# EAGLE design servo_driver_board (EAGLE 7.2.0)
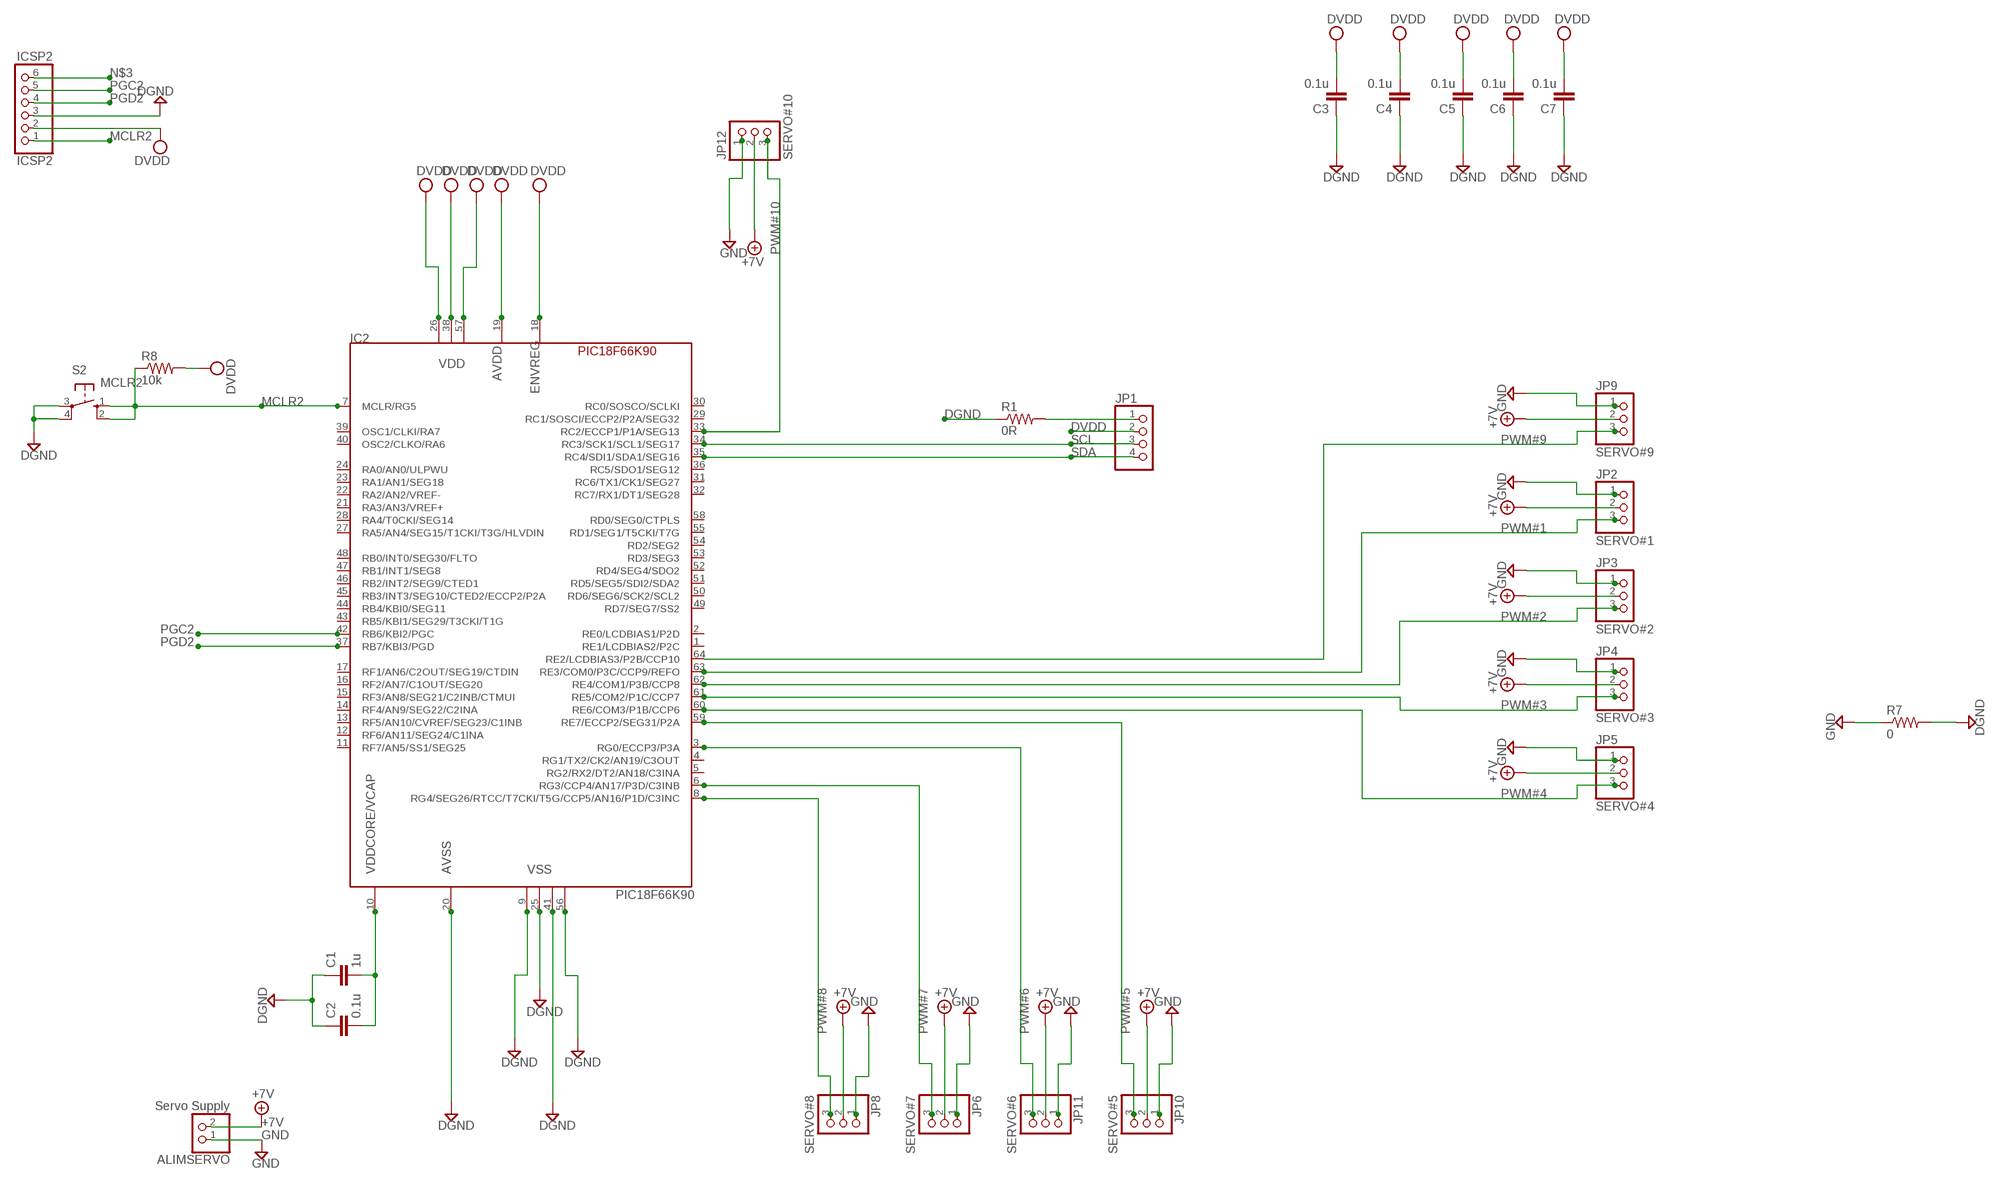
[diagram p0: schematic, sheet 1]

## Parts
ALIMSERVO  Servo Supply  PINHD-1X2  [1X02]
C1  1u  C-EUC0805  [C0805]
C2  0.1u  C-EUC0805  [C0805]
C3  0.1u  C-EUC0805  [C0805]
C4  0.1u  C-EUC0805  [C0805]
C5  0.1u  C-EUC0805  [C0805]
C6  0.1u  C-EUC0805  [C0805]
C7  0.1u  C-EUC0805  [C0805]
IC2  PIC18F66K90  [TQFP64-10X10]
ICSP2  ICSP2  PINHD-1X6  [1X06]
JP1  PINHD-1X4/90  [1X04/90]
JP2  SERVO#1  PINHD-1X3  [1X03]
JP3  SERVO#2  PINHD-1X3  [1X03]
JP4  SERVO#3  PINHD-1X3  [1X03]
JP5  SERVO#4  PINHD-1X3  [1X03]
JP6  SERVO#7  PINHD-1X3  [1X03]
JP8  SERVO#8  PINHD-1X3  [1X03]
JP9  SERVO#9  PINHD-1X3  [1X03]
JP10  SERVO#5  PINHD-1X3  [1X03]
JP11  SERVO#6  PINHD-1X3  [1X03]
JP12  SERVO#10  PINHD-1X3  [1X03]
R1  0R  R-US_R1206  [R1206]
R7  0  R-US_R1206  [R1206]
R8  10k  R-US_R1206  [R1206]
S2  MCLR2  10-XX  [B3F-10XX]

## Nets
+7V: ALIMSERVO.2 JP2.2 JP3.2 JP4.2 JP5.2 JP6.2 JP8.2 JP9.2 JP10.2 JP11.2 JP12.2
DGND: C1.1 C2.1 C3.1 C4.1 C5.1 C6.1 C7.1 IC2.9(VSS) IC2.20(AVSS) IC2.25(VSS) IC2.41(VSS) IC2.56(VSS) ICSP2.3 R1.1 R7.2 S2.3(P) S2.4(P1)
DVDD: C3.2 C4.2 C5.2 C6.2 C7.2 IC2.18(ENVREG) IC2.19(AVDD) IC2.26(VDD) IC2.38(VDD) IC2.57(VDD) ICSP2.2 JP1.2 R8.2
GND: ALIMSERVO.1 JP2.1 JP3.1 JP4.1 JP5.1 JP6.1 JP8.1 JP9.1 JP10.1 JP11.1 JP12.1 R7.1
MCLR2: IC2.7(MCLR/RG5) ICSP2.1 R8.1 S2.1(S) S2.2(S1)
N$2: JP1.1 R1.2
N$3: ICSP2.6
N$15: C1.2 C2.2 IC2.10(VDDCORE/VCAP)
PGC2: IC2.42(RB6/KBI2/PGC) ICSP2.5
PGD2: IC2.37(RB7/KBI3/PGD) ICSP2.4
PWM#1: IC2.63(RE3/COM0/P3C/CCP9/REFO) JP2.3
PWM#2: IC2.62(RE4/COM1/P3B/CCP8) JP3.3
PWM#3: IC2.61(RE5/COM2/P1C/CCP7) JP4.3
PWM#4: IC2.60(RE6/COM3/P1B/CCP6) JP5.3
PWM#5: IC2.59(RE7/ECCP2/SEG31/P2A) JP10.3
PWM#6: IC2.3(RG0/ECCP3/P3A) JP11.3
PWM#7: IC2.6(RG3/CCP4/AN17/P3D/C3INB) JP6.3
PWM#8: IC2.8(RG4/SEG26/RTCC/T7CKI/T5G/CCP5/AN16/P1D/C3INC) JP8.3
PWM#9: IC2.64(RE2/LCDBIAS3/P2B/CCP10) JP9.3
PWM#10: IC2.33(RC2/ECCP1/P1A/SEG13) JP12.3
SCL: IC2.34(RC3/SCK1/SCL1/SEG17) JP1.3
SDA: IC2.35(RC4/SDI1/SDA1/SEG16) JP1.4
Unconnected: IC2.1(RE1/LCDBIAS2/P2C) IC2.2(RE0/LCDBIAS1/P2D) IC2.4(RG1/TX2/CK2/AN19/C3OUT) IC2.5(RG2/RX2/DT2/AN18/C3INA) IC2.11(RF7/AN5/SS1/SEG25) IC2.12(RF6/AN11/SEG24/C1INA) IC2.13(RF5/AN10/CVREF/SEG23/C1INB) IC2.14(RF4/AN9/SEG22/C2INA) IC2.15(RF3/AN8/SEG21/C2INB/CTMUI) IC2.16(RF2/AN7/C1OUT/SEG20) IC2.17(RF1/AN6/C2OUT/SEG19/CTDIN) IC2.21(RA3/AN3/VREF+) IC2.22(RA2/AN2/VREF-) IC2.23(RA1/AN1/SEG18) IC2.24(RA0/AN0/ULPWU) IC2.27(RA5/AN4/SEG15/T1CKI/T3G/HLVDIN) IC2.28(RA4/T0CKI/SEG14) IC2.29(RC1/SOSCI/ECCP2/P2A/SEG32) IC2.30(RC0/SOSCO/SCLKI) IC2.31(RC6/TX1/CK1/SEG27) IC2.32(RC7/RX1/DT1/SEG28) IC2.36(RC5/SDO1/SEG12) IC2.39(OSC1/CLKI/RA7) IC2.40(OSC2/CLKO/RA6) IC2.43(RB5/KBI1/SEG29/T3CKI/T1G) IC2.44(RB4/KBI0/SEG11) IC2.45(RB3/INT3/SEG10/CTED2/ECCP2/P2A) IC2.46(RB2/INT2/SEG9/CTED1) IC2.47(RB1/INT1/SEG8) IC2.48(RB0/INT0/SEG30/FLTO) IC2.49(RD7/SEG7/SS2) IC2.50(RD6/SEG6/SCK2/SCL2) IC2.51(RD5/SEG5/SDI2/SDA2) IC2.52(RD4/SEG4/SDO2) IC2.53(RD3/SEG3) IC2.54(RD2/SEG2) IC2.55(RD1/SEG1/T5CKI/T7G) IC2.58(RD0/SEG0/CTPLS)

## Notes on the sheet
- PWM#10
- PWM#9
- PWM#1
- PWM#2
- PWM#3
- PWM#4
- PWM#8 | PWM#7 | PWM#6 | PWM#5

## Library data of the parts
ALIMSERVO = pinhead:PINHD-1X2: PIN HEADER
C1-C7 = rcl:C-EU: CAPACITOR, European symbol
IC2 = PIC18F66K90:PIC18F66K90: DATASHEET: http://ww1.microchip.com/downloads/en/DeviceDoc/39957d.pdf Por Nicolás Cifuentes.
ICSP2 = pinhead:PINHD-1X6: PIN HEADER
JP1 = pinhead:PINHD-1X4: PIN HEADER
JP2-JP6 JP8-JP12 = pinhead:PINHD-1X3: PIN HEADER
R1 R7 R8 = rcl:R-US_: RESISTOR, American symbol
S2 = switch-omron:10-XX: OMRON SWITCH; MPN: B3F-1000; OC_FARNELL: 176432; OC_NEWARK: 36M3542

## Board
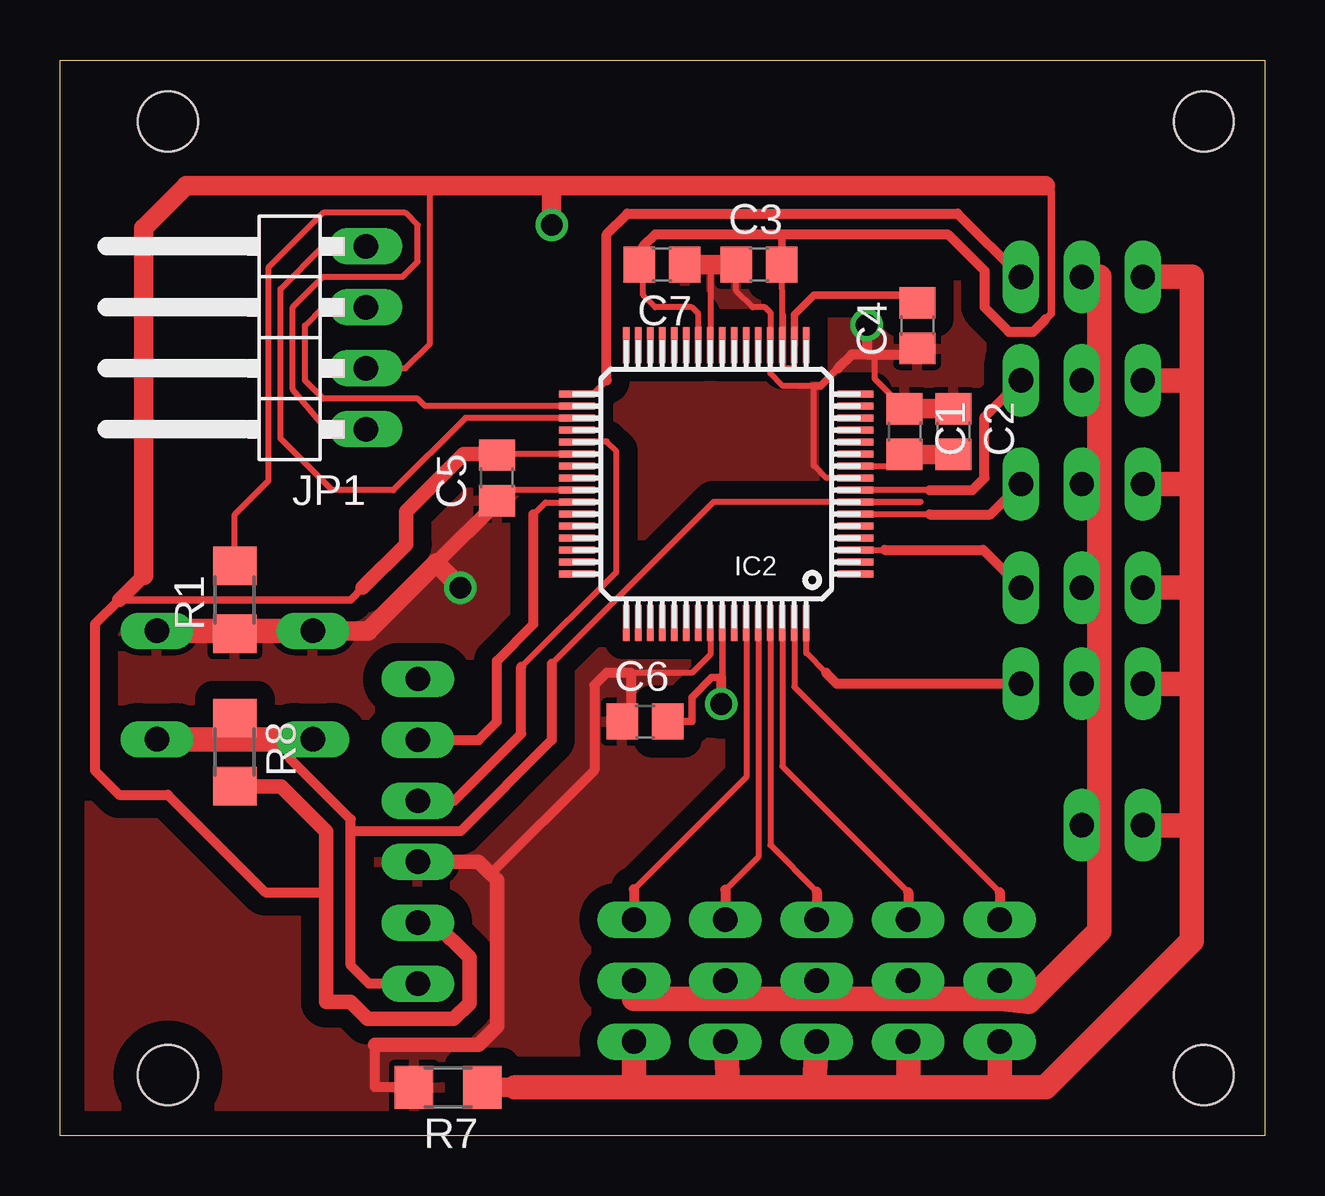
[diagram p1: board, top side]
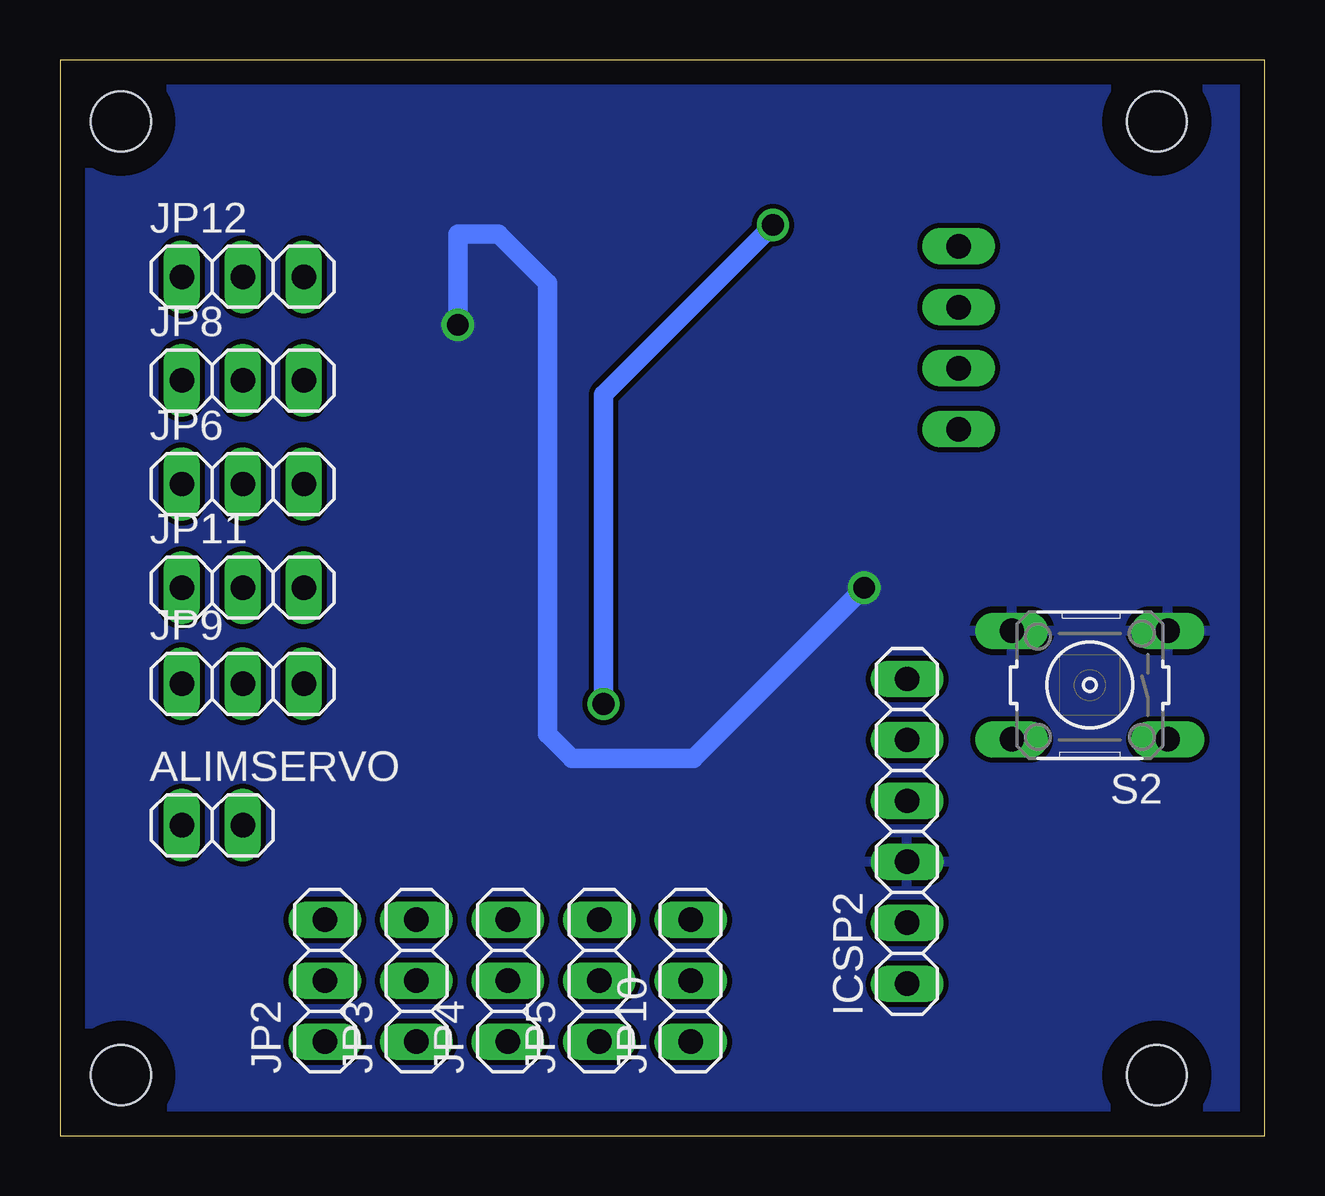
[diagram p2: board, bottom side, seen from below]

Size 50.22 x 44.85 mm. Coordinates in mm from the lower left corner, seen from the top.
Outline: 50.22,0 0,0 0,44.85 50.22,44.85 50.22,0
Copper layers (1*16): Top 0.035mm / dielectric 1.5mm / Bottom 0.035mm
Design rules "default": minimum track width 10mil, minimum drill 24mil, track to track 8mil, track to pad 8mil, pad to pad 8mil, via to via 8mil, smd to smd 8mil, copper to edge 40mil, drill to drill 8mil, minimum pad ring 10mil, minimum via ring 8mil, stop-mask expansion 4mil, vias tented up to drill 0mil, thermal gap 10mil
Holes 2.5 mm at 4.5,42.29 4.5,2.54 47.68,42.29 47.68,2.54

### Footprints (pad centres in the part's own frame; a part is rotated, then mirrored left to right if it is on the bottom)
1X02 = drill 1.016 long: 1 -1.27,0; 2 1.27,0
C0805 = smd 1.3 x 1.5: 1 -0.95,0; 2 0.95,0
TQFP64-10X10 = smd 1.5 x 0.28: 1 -5.8,3.75; 2 -5.8,3.25; 3 -5.8,2.75; 4 -5.8,2.25; 5 -5.8,1.75; 6 -5.8,1.25; 7 -5.8,0.75; 8 -5.8,0.25; 9 -5.8,-0.25; 10 -5.8,-0.75; 11 -5.8,-1.25; 12 -5.8,-1.75; 13 -5.8,-2.25; 14 -5.8,-2.75; 15 -5.8,-3.25; 16 -5.8,-3.75; 33 5.8,-3.75; 34 5.8,-3.25; 35 5.8,-2.75; 36 5.8,-2.25; 37 5.8,-1.75; 38 5.8,-1.25; 39 5.8,-0.75; 40 5.8,-0.25; 41 5.8,0.25; 42 5.8,0.75; 43 5.8,1.25; 44 5.8,1.75; 45 5.8,2.25; 46 5.8,2.75; 47 5.8,3.25; 48 5.8,3.75 | smd 0.28 x 1.5: 17 -3.75,-5.8; 18 -3.25,-5.8; 19 -2.75,-5.8; 20 -2.25,-5.8; 21 -1.75,-5.8; 22 -1.25,-5.8; 23 -0.75,-5.8; 24 -0.25,-5.8; 25 0.25,-5.8; 26 0.75,-5.8; 27 1.25,-5.8; 28 1.75,-5.8; 29 2.25,-5.8; 30 2.75,-5.8; 31 3.25,-5.8; 32 3.75,-5.8; 49 3.75,5.8; 50 3.25,5.8; 51 2.75,5.8; 52 2.25,5.8; 53 1.75,5.8; 54 1.25,5.8; 55 0.75,5.8; 56 0.25,5.8; 57 -0.25,5.8; 58 -0.75,5.8; 59 -1.25,5.8; 60 -1.75,5.8; 61 -2.25,5.8; 62 -2.75,5.8; 63 -3.25,5.8; 64 -3.75,5.8
1X06 = drill 1.016 long: 1 -6.35,0; 2 -3.81,0; 3 -1.27,0; 4 1.27,0; 5 3.81,0; 6 6.35,0
1X04/90 = drill 1.016 long: 1 -3.81,-3.81; 2 -1.27,-3.81; 3 1.27,-3.81; 4 3.81,-3.81
1X03 = drill 1.016 long: 1 -2.54,0; 2 0,0; 3 2.54,0
R1206 = smd 1.6 x 1.803: 1 -1.422,0; 2 1.422,0
B3F-10XX = drill 1.016 long: 1 -3.251,2.261; 2 3.251,2.261; 3 -3.251,-2.261; 4 3.251,-2.261

### Placement (x,y rotation side)
ALIMSERVO  43.87,12.95 0 bottom
C1  35.2,29.36 270 top
C2  37.24,29.36 270 top
C3  29.13,36.32 0 top
C4  35.74,33.78 90 top
C5  18.21,27.43 90 top
C6  24.38,17.27 0 top
C7  25.1,36.32 180 top
IC2  27.36,27.18 180 top
ICSP2  14.91,12.7 90 bottom
JP1  8.94,33.27 90 top
JP2  39.17,6.48 90 bottom
JP3  35.36,6.48 90 bottom
JP4  31.55,6.48 90 bottom
JP5  27.74,6.48 90 bottom
JP6  42.6,27.18 0 bottom
JP8  42.6,31.5 0 bottom
JP9  42.6,18.85 0 bottom
JP10  23.93,6.48 90 bottom
JP11  42.6,22.86 0 bottom
JP12  42.6,35.81 0 bottom
R1  7.29,22.35 90 top
R7  16.18,2.03 180 top
R8  7.29,16 270 top
S2  7.29,18.8 180 bottom

### Tracks (layer width: path | path; a pad name or v marks a point on that pad's centre or on a via)
+7V
  Top 1.016: JP12.2 43.33,35.81 43.33,31.5 | 43.33,31.5 43.33,27.18 | 43.33,27.18 43.33,22.86 | 43.33,22.86 43.33,18.8 | 43.33,18.8 43.33,12.95 | 43.33,12.95 43.33,8.56 40.36,5.59 39.17,5.71 | JP8.2 43.33,31.5 | JP6.2 43.33,27.18 | JP11.2 43.33,22.86 | 39.17,5.71 35.36,5.71 | 35.36,5.71 31.55,5.71 | 31.55,5.71 27.74,5.71 | 27.74,5.71 23.93,5.71 JP10.2 | JP2.2 39.17,5.71 | JP3.2 35.36,5.71 | JP4.2 31.55,5.71 | JP5.2 27.74,5.71 | JP9.2 42.6,18.8 43.33,18.8 | ALIMSERVO.2 43.33,12.95
DGND  (via drill 0.9 pad 1.3)
  Top 0.254: IC2.41 18.66,26.93 C5.1 | IC2.9 31.93,27.43 31.42,27.94 31.42,31.27 30.12,31.27 29.61,31.79 IC2.20 29.61,34.33 29.39,34.54 28.88,34.54 28.18,35.24 28.18,35.75 | IC2.25 27.11,36.32 26.85,36.32 | C6.1 23.87,17.85 | IC2.56 27.11,20.07 26.34,19.3 23.8,19.3 | 28.18,35.75 C3.1 | 28.18,35.75 28.12,35.81 28.12,36.32 | C1.1 33.96,31.56 33.96,32.51
  Top 0.305: 31.42,31.27 31.7,31.27 32.44,32 | 35.74,32.58 C4.1
  Top 0.406: S2.3 6.76,21.06 7.04,21.34 | 17.96,10.92 22.28,15.24 22.28,18.8 22.78,19.3 23.8,19.3 23.8,17.34 C6.1 | R7.2 13.13,2.03 13.13,3.81 | 33.63,32.58 33.01,32.58 32.44,32 | v33.63,33.81 33.63,32.58 | 33.63,32.58 35.74,32.58
  Top 0.61: ICSP2.3 17.45,11.43 17.96,10.92 18.21,10.67 18.21,4.57 17.45,3.81 13.13,3.81 | S2.4 12.85,21.06 | 15.67,23.88 18.21,26.42 C5.1
  Top 0.813: C2.1 C1.1 | S2.3 12.85,21.06 15.67,23.88 v16.69,22.86 | 28.12,36.32 26.85,36.32 C7.1
  Top 1.016: S2.3 S2.4
  Bottom 0.813: v33.63,33.81 33.63,37.59 31.93,37.59 29.9,35.56 29.9,16.76 28.88,15.75 23.8,15.75 v16.69,22.86
  pour Top (isolate 0.762): 50.85,45.21 -0.58,45.59 -0.71,-0.64 50.72,-1.02
  pour Bottom: 51.23,45.09 -1.47,45.34 -0.33,-0.76 51.23,-1.52
DVDD  (via drill 0.9, 0.9 pad 1.3)
  Top 0.254: IC2.38 18.23,28.43 18.21,28.45 | IC2.19 30.11,34.27 | 30.11,34.27 C3.2 | 35.16,35.05 C4.2 | 27.61,19.11 IC2.57 27.61,19.15 27.56,19.1 | 24.31,37.08 24.31,36.48 | 24.31,36.48 C7.2 | 30.11,34.27 30.14,34.24 30.14,32 30.61,32 30.61,34.04 | 24.31,36.07 24.14,36.23 C7.2 | 24.31,36.16 24.31,35.05 24.82,34.54 26.34,34.54 26.61,34.28 IC2.26 | 24.31,36.16 C7.2 | 24.31,36.16 24.31,36.48 | 24.82,37.59 31.42,37.59 | JP1.2 14.4,32 15.42,33.02 15.42,39.24 15.8,39.62
  Top 0.305: 2.46,22.35 12.12,22.35 12.62,22.86 | 35.16,35.05 31.42,35.05 30.61,34.24 30.61,34.04 IC2.18 | 41.07,39.62 41.33,39.37 41.33,34.29 41.07,34.04 | 30.4,37.59 30.08,37.59 C3.2 | 27.61,19.11 27.16,19.11 26.34,18.29 26.34,17.27 C6.2
  Top 0.406: 2.46,22.35 1.45,21.34 1.45,15.24 2.46,14.22 4.5,14.22 8.56,10.16 11.1,10.16 | 25.77,17.71 C6.2 | 27.56,19.1 v27.56,18.01 | 24.31,37.08 24.82,37.59 30.4,37.59 31.42,37.59 37.01,37.59 38.53,36.07 38.53,34.54 39.55,33.53 40.56,33.53 41.07,34.04
  Top 0.61: ICSP2.2 15.62,8.89 17.07,7.44 17.07,5.54 16.41,4.88 12.83,4.88 12.12,5.59 11.1,5.59 11.1,10.16 11.1,12.7 9.22,14.58 R8.2 | C5.2 18.17,28.43 17.7,28.43 16.82,28.43 14.43,26.04 14.43,24.66 12.62,22.86 | 3.48,23.37 2.46,22.35
  Top 0.813: 20.5,39.62 15.8,39.62 5.26,39.62 3.48,37.85 3.48,23.37 | 20.5,39.62 41.07,39.62 | 18.23,28.43 17.7,28.43 | v20.5,37.97 20.5,39.62
  Bottom 0.813: v27.56,18.01 27.56,30.91 v20.5,37.97
GND
  Top 0.813: R7.1 18.97,2.03
  Top 1.016: 47.17,12.95 47.17,8.13 41.07,2.03 39.17,2.03 | 47.17,12.95 47.17,18.85 | 47.17,18.85 47.17,22.86 | 47.17,22.86 47.17,27.18 | 47.17,27.18 47.17,31.5 | 45.39,35.81 JP12.1 47.17,35.81 47.17,31.5 | JP8.1 47.17,31.5 | JP11.1 47.17,22.86 | JP6.1 47.17,27.18 | 39.17,2.03 35.36,2.03 | 35.36,2.03 31.42,2.03 | 31.42,2.03 27.86,2.03 | 27.86,2.03 23.93,2.03 | 23.93,2.03 18.97,2.03 | JP10.1 23.93,2.03 | JP5.1 27.86,2.03 | JP4.1 31.42,2.03 | JP3.1 35.36,2.03 | JP2.1 39.17,2.03 | JP9.1 47.17,18.85 | ALIMSERVO.1 47.17,12.95
MCLR2
  Top 0.254: 20.5,19.68 27.24,26.43 35.88,26.43 IC2.7
  Top 0.406: ICSP2.1 12.88,6.35 12.12,7.11 12.12,12.7 | 12.12,12.7 12.12,13.21 9.58,15.75 9.58,16.54 | 20.5,19.68 20.5,16.51 16.69,12.7 12.12,12.7
  Top 1.016: S2.2 9.58,16.54 7.93,16.54 | 7.93,16.54 R8.1 | S2.1 7.93,16.54
N$2
  Top 0.254: JP1.1 11.1,29.46 9.7,31.12 9.7,34.54 10.97,35.81 14.28,35.81 14.91,36.45 14.91,37.97 14.4,38.48 10.97,38.48 8.69,36.2 8.69,27.3 7.29,25.91 R1.2
N$15
  Top 0.254: IC2.10 34.96,27.93 35.74,28.19 35.97,28.16 35.71,28.41
  Top 0.813: C2.2 35.71,28.41 C1.2
PGC2
  Top 0.254: 19.74,25.91 20.24,26.42 IC2.42
  Top 0.406: ICSP2.5 17.45,16.51 18.21,17.27 18.21,19.81 19.74,21.34 19.74,25.91
PGD2
  Top 0.254: 19.23,19.56 23.19,23.52 23.19,28.55 22.78,28.96 21.58,28.96 IC2.37
  Top 0.406: ICSP2.4 16.43,13.97 19.23,16.76 19.23,19.56
PWM#1
  Top 0.254: IC2.63 30.61,18.72 39.17,10.16
  Top 0.406: 39.17,10.16 JP2.3
PWM#2
  Top 0.254: IC2.62 30.11,15.41 35.36,10.16
  Top 0.406: 35.36,10.16 JP3.3
PWM#3
  Top 0.254: 31.55,10.18 29.61,12.13 IC2.61
  Top 0.406: 31.55,10.18 JP4.3
PWM#4
  Top 0.254: IC2.60 29.11,11.63 27.74,10.26
  Top 0.406: 27.74,10.26 JP5.3
PWM#5
  Top 0.254: IC2.59 28.61,14.97 23.93,10.29
  Top 0.406: 23.93,10.29 JP10.3
PWM#6
  Top 0.254: IC2.3 34.36,24.43 34.37,24.43
  Top 0.406: JP11.3 38.48,24.43 34.37,24.43
PWM#7
  Top 0.254: 36.25,25.91 33.18,25.91 IC2.6
  Top 0.406: 36.25,25.91 38.79,25.91 JP6.3
PWM#8
  Top 0.254: 36.25,26.92 32.65,26.92 IC2.8
  Top 0.406: 36.25,26.92 38.02,26.92 38.53,27.43 38.53,29.97 JP8.3
PWM#9
  Top 0.254: 31.93,19.3 31.11,20.13 IC2.64
  Top 0.406: JP9.3 32.39,18.85 31.93,19.3
PWM#10
  Top 0.254: IC2.33 22.22,30.93 22.78,31.5
  Top 0.406: 22.78,31.5 22.78,37.59 23.65,38.46 37.41,38.46 JP12.3
SCL
  Top 0.254: IC2.34 15.22,30.43 14.91,30.73 10.97,30.73 10.21,31.5 10.21,33.78 10.97,34.54 JP1.3
SDA
  Top 0.254: IC2.35 16.9,29.93 13.89,26.92 11.35,26.92 9.2,29.08 9.2,35.31 10.97,37.08 JP1.4